# Altium project LP_ECG-X02.PrjPcb (part 3 of 3)

## Sheet LP_ECG_Power-X02.SchDoc: DB POWER
size Letter; Author: C. DEMOLDER; Engineer: C. DEMOLDER; Organization: GEORGIA TECH; Address1: NORTH AVE NW; Address2: ATLANTA, GA, 30332; DocumentNumber: P001; Revision: X01; SheetNumber: 3; SheetTotal: 4
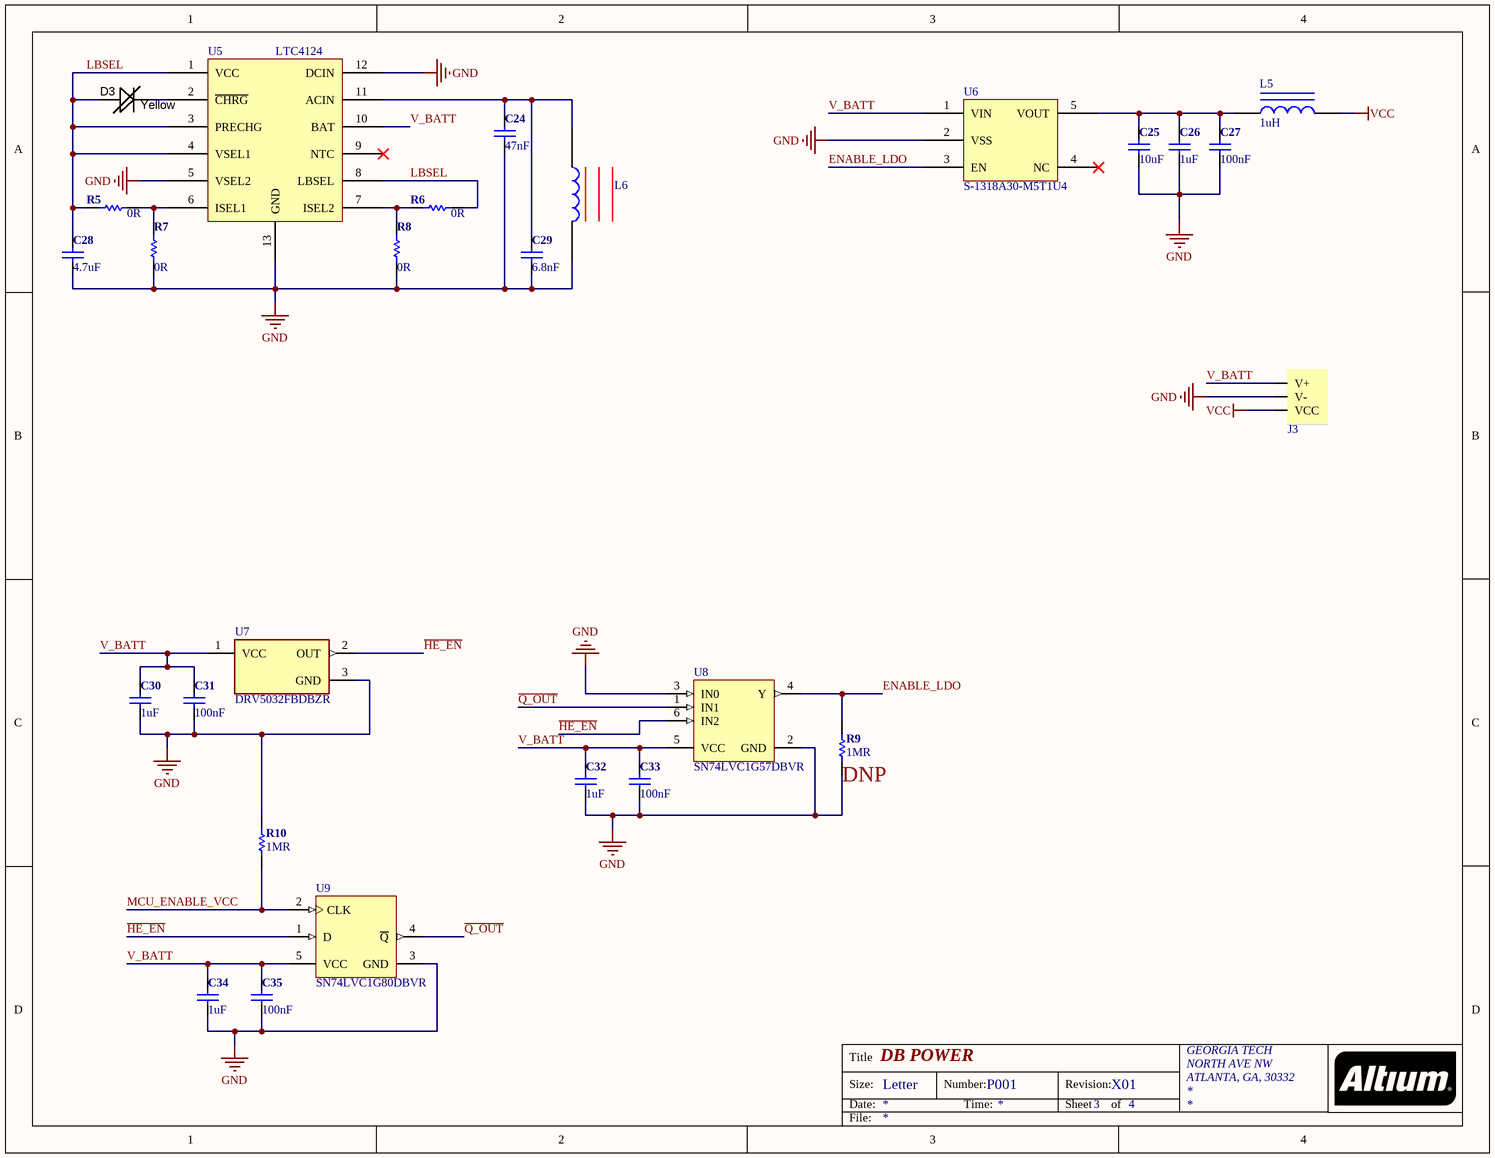
[diagram p2: LP_ECG_Power-X02.SchDoc]

### Parts
C24  47nF  [C0402]
C25  10uF  [C0402]
C26  1uF  [C0402]
C27  100nF  [C0402]
C28  4.7uF  [C0402]
C29  6.8nF  [C0402]
C30  1uF  [C0402]
C31  100nF  [C0402]
C32  1uF  [C0402]
C33  100nF  [C0402]
C34  1uF  [C0402]
C35  100nF  [C0402]
D3  Yellow  [LED_0402]
J3  SMD CONNECTOR FOR 40 mAh BATTERY  [battery_connector]  (value not drawn)
L5  1uH  [L0402]
L6  WIRELESS CHARGING COIL, RECEIVER  [760308101219]  (value not drawn)
R5  0R  [R0402]
R6  0R  [R0402]
R7  0R  [R0402]
R8  0R  [R0402]
R9  1MR  [R0402]
R10  1MR  [R0402]
U5  LTC4124  [12-LQFN]
U6  S-1318A30-M5T1U4  [SOT-23-5]
U7  DRV5032FBDBZR  [FP-DBZ0003A-MFG]
U8  SN74LVC1G57DBVR  [DBV0006A_M]
U9  SN74LVC1G80DBVR  [DBV0005A_N]

### Nets
GND: C24.2 C25.2 C26.2 C27.1 C28.2 C29.2 C30.2 C31.1 C32.2 C33.1 C34.2 C35.1 J3.2(V-) L6.2 R7.2 R8.2 R9.2 R10.1 U5.5(VSEL2) U5.12(DCIN) U5.13(GND) U6.2(VSS) U7.3(GND) U8.2(GND) U8.3(IN0) U9.3(GND)
VCC: J3.3(VCC) L5.2
~{HE_EN}: U7.2(OUT) U8.6(IN2) U9.1(D)
~{Q_OUT}: U8.1(IN1) U9.4(~{Q})
ENABLE_LDO: R9.1 U6.3(EN) U8.4(Y)
LBSEL: C28.1 D3.A R5.1 R6.2 U5.1(VCC) U5.3(PRECHG) U5.4(VSEL1) U5.8(LBSEL)
MCU_ENABLE_VCC: R10.2 U9.2(CLK)
V_BATT: C30.1 C31.2 C32.1 C33.2 C34.1 C35.2 J3.1(V+) U5.10(BAT) U6.1(VIN) U7.1(VCC) U8.5(VCC) U9.5(VCC)
NetC24_1: C24.1 C29.1 L6.1 U5.11(ACIN)
NetC25_1: C25.1 C26.1 C27.2 L5.1 U6.5(VOUT)
NetD3_K: D3.K U5.2(~{CHRG})
NetR5_2: R5.2 R7.1 U5.6(ISEL1)
NetR6_1: R6.1 R8.1 U5.7(ISEL2)

Not connected (* = marked no-connect by the designer): U5 9(NTC)*; U6 4(NC)*

### Notes on the sheet
- (near R9) DNP
- Title
- Size:
- Date:
- Letter
- Number:
- Time:
- Revision:
- Sheet
- of
- File:

### Library data of the parts
C24 = C-0402(1005): Ceramic Capacitor, Multilayer, Ceramic, 50V, 10% +Tol, 10% -Tol, X7R, 15% TC, 0.047uF, Surface Mount, 0402; Manufacturer: Murata; Manufacturer Part Number: GCM155R71H473KE02D; Multilayer: Yes; Reference Standard: AEC-Q200; ComponentLink1URL: https://datasheet.ciiva.com/169/product-169683.pdf; ComponentLink1Description: https://datasheet.ciiva.com/169/product-169683.pdf; Supplier 1: Digi-Key; Supplier Part Number 1: 490-13297-1-ND; RoHS: Yes; Category: Ceramic Capacitors; Stock 1: 809; Pricing 1: 1=0.10000, 10=0.05300, 50=0.02900, 100=0.02370, 500=0.01694, 1000=0.01331, 2500=0.01210, 5000=0.01113 (USD); Mount: Surface Mount; Number of Pins: 2; Dielectric Material: Ceramic; Package Shape: Rectangular; Size Code: 0402; Terminal Finish: Nickel; Min Operating Temperature: -55°C; Max Operating Temperature: 125°C; JESD-609 Code: e3; Capacitance: 47nF; Capacitor Type: Ceramic; Negative Tolerance: 10%; Package Style: SMTMeter; Packaging: Tape and Reel; Positive Tolerance: 10%; Rated DC Voltage (URdc): 50V; Temperature Characteristics Code: X7R; Termination: Wraparound; Length: 1mm; Width: 0.5mm; Height: 0.55mm; REACH SVHC: Yes; RoHS Compliant: Yes; ComponentLink2URL: https://datasheet.ciiva.com:443/pdfs/VipMasterIC/IC/MURE/MURE-S-A0004370842/MURE-S-A0004372843-1.pdf?src-supplier=IHS+Markit; ComponentLink2Description: https://datasheet.ciiva.com:443/pdfs/VipMasterIC/IC/MURE/MURE-S-A0004370842/MURE-S-A0004372843-1.pdf?src-supplier=IHS+Markit; ComponentLink3URL: http://www.mouser.com/ds/2/281/c03e-806517.pdf?src-supplier=Mouser; ComponentLink3Description: http://www.mouser.com/ds/2/281/c03e-806517.pdf?src-supplier=Mouser; ComponentLink4URL: http://www.murata.com/~/media/webrenewal/support/library/catalog/products/capacitor/mlcc/c03e.ashx?src-supplier=Digi-Key; ComponentLink4Description: http://www.murata.com/~/media/webrenewal/support/library/catalog/products/capacitor/mlcc/c03e.ashx?src-supplier=Digi-Key; ComponentLink5URL: http://search.murata.co.jp/Ceramy/image/img/A01X/G101/ENG/GCM155R71H473KE02-01.pdf?src-supplier=Digi-Key; ComponentLink5Description: http://search.murata.co.jp/Ceramy/image/img/A01X/G101/ENG/GCM155R71H473KE02-01.pdf?src-supplier=Digi-Key; ComponentLink6URL: http://search.murata.co.jp/Ceramy/image/img/A01X/partnumbering_e_02.pdf?src-supplier=Digi-Key; ComponentLink6Description: http://search.murata.co.jp/Ceramy/image/img/A01X/partnumbering_e_02.pdf?src-supplier=Digi-Key
C25 = C-0402(1005): Ceramic Capacitor, Non-polarized, Multilayer, Ceramic, 10V, 20% +Tol, 20% -Tol, X5R, 15% TC, 10uF, Surface Mount, 0402; Manufacturer: Kyocera AVX; Manufacturer Part Number: 0402ZD106MAT2A; Multilayer: Yes; ComponentLink1URL: https://datasheet.ciiva.com/169/product-169683.pdf; ComponentLink1Description: https://datasheet.ciiva.com/169/product-169683.pdf; Supplier 1: Digi-Key; Supplier Part Number 1: 478-10052-1-ND; RoHS: No; Category: Ceramic Capacitors; Stock 1: 111382; Pricing 1: 1=0.85000, 10=0.62400, 50=0.49900, 100=0.42770, 500=0.33858, 1000=0.28512, 2500=0.26730, 5000=0.24948 (USD); Mount: Surface Mount; Number of Pins: 2; Dielectric Material: Ceramic; Package Shape: Rectangular; Size Code: 0402; Terminal Finish: Nickel; Min Operating Temperature: -55°C; Max Operating Temperature: 85°C; JESD-609 Code: e3; Capacitance: 10uF; Capacitor Type: Ceramic; Negative Tolerance: 20%; Packaging: Tape and Reel; Positive Tolerance: 20%; Rated DC Voltage (URdc): 10V; Temperature Characteristics Code: X5R; Termination: Wraparound; ComponentLink2URL: https://datasheet.ciiva.com:443/pdfs/VipMasterIC/IC/AVXC/AVXC-S-A0009640604/AVXC-S-A0009640604-1.pdf?src-supplier=IHS+Markit; ComponentLink2Description: https://datasheet.ciiva.com:443/pdfs/VipMasterIC/IC/AVXC/AVXC-S-A0009640604/AVXC-S-A0009640604-1.pdf?src-supplier=IHS+Markit; ComponentLink3URL: http://datasheets.avx.com/cx5r.pdf?src-supplier=Digi-Key; ComponentLink3Description: http://datasheets.avx.com/cx5r.pdf?src-supplier=Digi-Key; ComponentLink4URL: http://catalogs.avx.com/SurfaceMount.pdf?src-supplier=Digi-Key; ComponentLink4Description: http://catalogs.avx.com/SurfaceMount.pdf?src-supplier=Digi-Key
C26 C30 C32 C34 = C-0402(1005): Ceramic Capacitor, Multilayer, Ceramic, 6.3V, 20% +Tol, 20% -Tol, X5R, 15% TC, 1uF, Surface Mount, 0402; Manufacturer: Yageo; Manufacturer Part Number: CC0402MRX5R5BB105; Dissipation Factor: 10%; ComponentLink1URL: https://datasheet.ciiva.com/169/product-169683.pdf; ComponentLink1Description: https://datasheet.ciiva.com/169/product-169683.pdf; Supplier 1: Digi-Key; Supplier Part Number 1: 311-1441-1-ND; RoHS: Yes; Category: Ceramic Capacitors; Stock 1: 16697; Pricing 1: 1=0.13000, 10=0.08900, 100=0.04200, 500=0.02946, 1000=0.02439, 2500=0.02270, 5000=0.02076 (USD); Mount: Surface Mount; Case/Package: 0402; Number of Pins: 2; Case Code (Imperial): 0402; Case Code (Metric): 1005; Min Operating Temperature: -55°C; Max Operating Temperature: 85°C; Capacitance: 1uF; Tolerance: 20%; Voltage Rating: 6.3V; Voltage Rating (DC): 6.3V; Packaging: Tape and Reel; Package Quantity: 1; Dielectric: X5R; Termination: SMD/SMT; Composition: Ceramic; Length: 1mm; Height: 0.5mm; Width: 0.5mm; Thickness: 0.022inch; Depth: 0.5mm; Lead Free: Lead Free; Halogen Free: Halogen Free; ComponentLink2URL: https://datasheet.ciiva.com:443/pdfs/VipMasterIC/IC/YAGO/YAGO-S-A0006851646/YAGO-S-A0006851646-1.pdf?src-supplier=IHS+Markit; ComponentLink2Description: https://datasheet.ciiva.com:443/pdfs/VipMasterIC/IC/YAGO/YAGO-S-A0006851646/YAGO-S-A0006851646-1.pdf?src-supplier=IHS+Markit; ComponentLink3URL: https://datasheet.ciiva.com/176/mlccorderingcode-176806.pdf?src-supplier=Digi-Key; ComponentLink3Description: https://datasheet.ciiva.com/176/mlccorderingcode-176806.pdf?src-supplier=Digi-Key; ComponentLink4URL: https://datasheet.ciiva.com/176/mlccorderingcode-176807.pdf?src-supplier=Digi-Key; ComponentLink4Description: https://datasheet.ciiva.com/176/mlccorderingcode-176807.pdf?src-supplier=Digi-Key; ComponentLink5URL: https://datasheet.ciiva.com/176/mlccorderingcode-176808.pdf?src-supplier=Digi-Key; ComponentLink5Description: https://datasheet.ciiva.com/176/mlccorderingcode-176808.pdf?src-supplier=Digi-Key
C27 C31 C33 C35 = C-0402(1005): Ceramic Capacitor, Multilayer, Ceramic, 25V, 10% +Tol, 10% -Tol, X5R, 15% TC, 0.1uF, Surface Mount, 0402; Manufacturer: Taiyo Yuden; Manufacturer Part Number: TMK105BJ104KV-F; ComponentLink1URL: https://datasheet.ciiva.com/169/product-169683.pdf; ComponentLink1Description: https://datasheet.ciiva.com/169/product-169683.pdf; Supplier 1: Digi-Key; Supplier Part Number 1: 587-1456-1-ND; RoHS: Yes; Category: Ceramic Capacitors; Stock 1: 27456801; Pricing 1: 1=0.10000, 10=0.04600, 100=0.02050, 500=0.01464, 1000=0.01150, 2500=0.01045, 5000=0.00961 (USD); Mount: Surface Mount; Case/Package: 0402; Number of Pins: 2; Weight: 2.3E-05oz; Case Code (Imperial): 0402; Case Code (Metric): 1005; Min Operating Temperature: -55°C; Max Operating Temperature: 85°C; Capacitance: 100nF; Tolerance: 10%; Packaging: Tape and Reel; Dielectric: X5R; Voltage Rating (DC): 25V; Voltage Rating: 25V; Package Quantity: 1; Termination: SMD/SMT; Composition: Ceramic; Voltage: 25V; Length: 1mm; Height: 0.5mm; Width: 0.5mm; Depth: 0.5mm; Thickness: 0.022inch; REACH SVHC: No SVHC; Lead Free: Lead Free; Halogen Free: Halogen Free; ComponentLink2URL: https://datasheet.ciiva.com:443/pdfs/VipMasterIC/IC/TAIY/TAIY-S-A0009103435/TAIY-S-A0009103038-1.pdf?src-supplier=IHS+Markit; ComponentLink2Description: https://datasheet.ciiva.com:443/pdfs/VipMasterIC/IC/TAIY/TAIY-S-A0009103435/TAIY-S-A0009103038-1.pdf?src-supplier=IHS+Markit; ComponentLink3URL: https://datasheet.ciiva.com/30051/25tmk105bj104kv-f-30051094.pdf?src-supplier=Onlinecomponents.com; ComponentLink3Description: https://datasheet.ciiva.com/30051/25tmk105bj104kv-f-30051094.pdf?src-supplier=Onlinecomponents.com; ComponentLink4URL: https://datasheet.ciiva.com/15922/28tmk105bj104kv-f-15922315.pdf?src-supplier=Onlinecomponents.com; ComponentLink4Description: https://datasheet.ciiva.com/15922/28tmk105bj104kv-f-15922315.pdf?src-supplier=Onlinecomponents.com; ComponentLink5URL: https://datasheet.ciiva.com/131/tmk105bj104kv-f-ss-131420.pdf?src-supplier=Digi-Key; ComponentLink5Description: https://datasheet.ciiva.com/131/tmk105bj104kv-f-ss-131420.pdf?src-supplier=Digi-Key; ComponentLink6URL: https://datasheet.ciiva.com/22768/1693457-22768649.pdf?src-supplier=Farnell; ComponentLink6Description: https://datasheet.ciiva.com/22768/1693457-22768649.pdf?src-supplier=Farnell
C28 = C-0402(1005): Ceramic Capacitor, Multilayer, Ceramic, 6.3V, 20% +Tol, 20% -Tol, X5R, 15% TC, 4.7uF, Surface Mount, 0402; Manufacturer: Murata; Manufacturer Part Number: GRM155R60J475ME87J; Multilayer: Yes; ComponentLink1URL: https://datasheet.ciiva.com/169/product-169683.pdf; ComponentLink1Description: https://datasheet.ciiva.com/169/product-169683.pdf; Supplier 1: Digi-Key; Supplier Part Number 1: 490-18211-1-ND; RoHS: Yes; Category: Ceramic Capacitors; Stock 1: 105828; Pricing 1: 1=0.15000, 10=0.10500, 50=0.05980, 100=0.04950, 500=0.03472, 1000=0.02875, 2500=0.02676, 5000=0.02448 (USD); Mount: Surface Mount; Number of Pins: 2; Dielectric Material: Ceramic; Package Shape: Rectangular; Size Code: 0402; Terminal Finish: Nickel; Min Operating Temperature: -55°C; Max Operating Temperature: 85°C; JESD-609 Code: e3; Capacitance: 4.7uF; Capacitor Type: Ceramic; Negative Tolerance: 20%; Package Style: SMTMeter; Packaging: Tape and Reel; Positive Tolerance: 20%; Rated DC Voltage (URdc): 6.3V; Temperature Characteristics Code: X5R; Termination: Wraparound; Length: 1mm; Width: 0.5mm; Height: 0.5mm; REACH SVHC: Yes; RoHS Compliant: Yes; ComponentLink2URL: https://datasheet.ciiva.com:443/pdfs/VipMasterIC/IC/MURE/MURE-S-A0004362469/MURE-S-A0004364141-1.pdf?src-supplier=IHS+Markit; ComponentLink2Description: https://datasheet.ciiva.com:443/pdfs/VipMasterIC/IC/MURE/MURE-S-A0004362469/MURE-S-A0004364141-1.pdf?src-supplier=IHS+Markit; ComponentLink3URL: https://search.murata.co.jp/Ceramy/image/img/A01X/G101/ENG/GRM155R60J475ME87-01.pdf?src-supplier=Digi-Key; ComponentLink3Description: https://search.murata.co.jp/Ceramy/image/img/A01X/G101/ENG/GRM155R60J475ME87-01.pdf?src-supplier=Digi-Key
C29 = C-0402(1005): Ceramic Capacitor, Multilayer, Ceramic, 50V, 10% +Tol, 10% -Tol, X7R, 15% TC, 0.0068uF, Surface Mount, 0402; Manufacturer: Murata; Manufacturer Part Number: GCM155R71H682KA55D; Multilayer: Yes; Reference Standard: AEC-Q200; ComponentLink1URL: https://datasheet.ciiva.com/169/product-169683.pdf; ComponentLink1Description: https://datasheet.ciiva.com/169/product-169683.pdf; Supplier 1: Digi-Key; Supplier Part Number 1: 490-11152-1-ND; RoHS: Yes; Category: Ceramic Capacitors; Stock 1: 86177; Pricing 1: 1=0.10000, 10=0.04500, 50=0.02460, 100=0.02020, 500=0.01440, 1000=0.01131, 2500=0.01028, 5000=0.00946 (USD); Mount: Surface Mount; Number of Pins: 2; Dielectric Material: Ceramic; Package Shape: Rectangular; Size Code: 0402; Terminal Finish: Nickel; Min Operating Temperature: -55°C; Max Operating Temperature: 125°C; JESD-609 Code: e3; Capacitance: 6.8nF; Capacitor Type: Ceramic; Negative Tolerance: 10%; Package Style: SMTMeter; Packaging: Tape and Reel; Positive Tolerance: 10%; Rated DC Voltage (URdc): 50V; Temperature Characteristics Code: X7R; Termination: Wraparound; Length: 1mm; Width: 0.5mm; Height: 0.55mm; REACH SVHC: Yes; RoHS Compliant: Yes; ComponentLink2URL: https://datasheet.ciiva.com:443/pdfs/VipMasterIC/IC/MURE/MURE-S-A0004370842/MURE-S-A0004371992-1.pdf?src-supplier=IHS+Markit; ComponentLink2Description: https://datasheet.ciiva.com:443/pdfs/VipMasterIC/IC/MURE/MURE-S-A0004370842/MURE-S-A0004371992-1.pdf?src-supplier=IHS+Markit; ComponentLink3URL: https://datasheet.ciiva.com/163/s0717e-163461.pdf?src-supplier=Digi-Key; ComponentLink3Description: https://datasheet.ciiva.com/163/s0717e-163461.pdf?src-supplier=Digi-Key
D3 = LED_0402(1005): Single Color LED, Super Bright Yellow, Water Clear, 0.8mm; Manufacturer: Kingbright; Manufacturer Part Number: APHHS1005SYCK; Test Current: 20mA; Forward Voltage: 2V; Luminous Intensity: 150mcd; Viewing Angle: 120°; Number of LEDs: 1; Dominant Wavelength: 590nm; Lens Style: Clear,Flat; Supplier 1: Digi-Key; Supplier Part Number 1: 754-1105-1-ND; RoHS: Yes; Category: LEDs; Stock 1: 1790; Pricing 1: 1=0.44000, 10=0.31200, 100=0.18200, 500=0.12480, 1000=0.10400 (USD); Mount: Surface Mount; Case/Package: 0402; Number of Pins: 2; Color: Yellow; Case Code (Imperial): 0402; Case Code (Metric): 1005; Lens Color: Clear; Min Operating Temperature: -40°C; Max Operating Temperature: 85°C; Illumination Color: Yellow; Forward Current: 20mA; Packaging: Tape and Reel; Package Quantity: 2000; Length: 1mm; Height: 0.6mm; Width: 0.5mm; Lead Free: Lead Free; ComponentLink1URL: https://datasheet.ciiva.com:443/pdfs/VipMasterIC/IC/KBEC/KBEC-S-A0008947180/KBEC-S-A0008958019-1.pdf?src-supplier=IHS+Markit; ComponentLink1Description: https://datasheet.ciiva.com:443/pdfs/VipMasterIC/IC/KBEC/KBEC-S-A0008947180/KBEC-S-A0008958019-1.pdf?src-supplier=IHS+Markit; ComponentLink2URL: https://datasheet.ciiva.com/4688/aphhs1005syck-76875-4688936.pdf?src-supplier=Mouser; ComponentLink2Description: https://datasheet.ciiva.com/4688/aphhs1005syck-76875-4688936.pdf?src-supplier=Mouser; ComponentLink3URL: https://datasheet.ciiva.com/2114/aphhs1005syck-2114041.pdf?src-supplier=Digi-Key; ComponentLink3Description: https://datasheet.ciiva.com/2114/aphhs1005syck-2114041.pdf?src-supplier=Digi-Key; ComponentLink4URL: https://datasheet.ciiva.com/14603/70062834-14603866.pdf?src-supplier=Allied+Electronics; ComponentLink4Description: https://datasheet.ciiva.com/14603/70062834-14603866.pdf?src-supplier=Allied+Electronics; ComponentLink5URL: https://datasheet.ciiva.com/2114/aphhs1005syck-2114043.pdf?src-supplier=Digi-Key; ComponentLink5Description: https://datasheet.ciiva.com/2114/aphhs1005syck-2114043.pdf?src-supplier=Digi-Key; ComponentLink6URL: https://datasheet.ciiva.com/16412/aphhs1005syck-16412188.pdf?src-supplier=Future+Electronics; ComponentLink6Description: https://datasheet.ciiva.com/16412/aphhs1005syck-16412188.pdf?src-supplier=Future+Electronics
J3 = SMD_BATTERY_CONNECTOR: Lithium Battery 3.7V 40mAh Rechargeable
L5 = Inductor Iron: General Purpose Inductor, 1uH, 20%, 1 Element, Ferrite-Core, SMD, 0402; Manufacturer: TDK; Manufacturer Part Number: MLZ1005M1R0WT000; Current Rating: 450mA; Saturation Current: 100mA; Shielding: Shielded; DC Resistance (DCR): 455mR; Self Resonant Frequency: 170MHz; Test Frequency: 2MHz; Supplier 1: Digi-Key; Supplier Part Number 1: 445-6379-1-ND; RoHS: Yes; Category: Fixed Inductors; Pricing 1: 1=0.29000, 10=0.25800, 100=0.17710, 500=0.15134, 1000=0.11592, 2500=0.10948 (USD); Mount: Surface Mount; Case/Package: 0402; Core Material: Ferrite; Case Code (Imperial): 0402; Case Code (Metric): 1005; Min Operating Temperature: -55°C; Max Operating Temperature: 125°C; Package Quantity: 10000; Packaging: Tape and Reel; Tolerance: 20%; Inductance: 1uH; Length: 0.039inch; Width: 0.02inch; Height - Seated (Max): 0.022inch; ComponentLink1URL: https://datasheet.ciiva.com:443/pdfs/VipMasterIC/IC/TDKC/TDKC-S-A0006811779/TDKC-S-A0006811779-1.pdf?src-supplier=IHS+Markit; ComponentLink1Description: https://datasheet.ciiva.com:443/pdfs/VipMasterIC/IC/TDKC/TDKC-S-A0006811779/TDKC-S-A0006811779-1.pdf?src-supplier=IHS+Markit; ComponentLink2URL: https://datasheet.ciiva.com/29699/inductor-commercial-decoupling-mlz-en-29699052.pdf?src-supplier=Digi-Key; ComponentLink2Description: https://datasheet.ciiva.com/29699/inductor-commercial-decoupling-mlz-en-29699052.pdf?src-supplier=Digi-Key; ComponentLink3URL: https://datasheet.ciiva.com/29699/inductor-commercial-decoupling-mlz-en-29699053.pdf?src-supplier=Digi-Key; ComponentLink3Description: https://datasheet.ciiva.com/29699/inductor-commercial-decoupling-mlz-en-29699053.pdf?src-supplier=Digi-Key
L6 = WIRELESS_CHARGING_COIL: General Purpose Inductor, 11.8uH, 10%, 1 Element; Manufacturer: Wurth Electronics; Current Rating: 700mA; Saturation Current: 1.5A; DC Resistance (DCR): 750mR; Self Resonant Frequency: 22MHz; Supplier 1: Digi-Key; Supplier Part Number 1: 732-9675-ND; Manufacturer Part Number: 760308101219; RoHS: Yes; Stock 1: 168; Pricing 1: 1=7.43000, 10=7.04000, 32=6.49000, 64=5.94000, 128=5.17000 (USD); Min Operating Temperature: -20°C; Max Operating Temperature: 105°C; Logic Function: Receiver; Inductance: 11.8uH; Tolerance: 10%; Inductance Tolerance: 10%; Height: 0.02inch; REACH SVHC: Unknown; ComponentLink1URL: https://datasheet.ciiva.com:443/pdfs/VipMasterIC/IC/MIDC/MIDC-S-A0003386501/MIDC-S-A0003386501-1.pdf?src-supplier=IHS+Markit; ComponentLink1Description: https://datasheet.ciiva.com:443/pdfs/VipMasterIC/IC/MIDC/MIDC-S-A0003386501/MIDC-S-A0003386501-1.pdf?src-supplier=IHS+Markit; ComponentLink2URL: http://www.farnell.com/datasheets/2039993.pdf?src-supplier=Farnell; ComponentLink2Description: http://www.farnell.com/datasheets/2039993.pdf?src-supplier=Farnell; ComponentLink3URL: http://www.farnell.com/datasheets/2039993.pdf?src-supplier=Element14; ComponentLink3Description: http://www.farnell.com/datasheets/2039993.pdf?src-supplier=Element14
R5-R8 = R-0402(1005): Fixed Resistor, Metal Glaze/thick Film, 0.0625W, 0ohm, Surface Mount, 0402; Manufacturer: Yageo; Manufacturer Part Number: AC0402JR-070RL; Rated Power Dissipation (P): 62.5mW; Rated Temperature: 70°C; Package Height: 0.32mm; Package Length: 1mm; Package Width: 0.5mm; Reference Standard: AEC-Q200; Supplier 1: Digi-Key; Supplier Part Number 1: 311-0.0LBCT-ND; RoHS: Yes; Category: Chip SMD Resistors; Stock 1: 1061562; Pricing 1: 1=0.10000, 10=0.01800, 25=0.01320, 50=0.01000, 100=0.00740, 250=0.00564, 500=0.00450, 1000=0.00331, 5000=0.00238 (USD); Mount: Surface Mount; Number of Pins: 2; Package Shape: Rectangular; Size Code: 0402; Terminal Finish: Nickel; Min Operating Temperature: -55°C; Max Operating Temperature: 155°C; JESD-609 Code: e3; Resistor Type: FIXED RESISTOR; Construction: Chip; Package Style: SMTMeter; Packaging: Tape and Reel; Resistance: 0R; Technology: METAL GLAZE/THICK FILM; Termination: Wraparound; REACH SVHC: Yes; RoHS Compliant: Yes; ComponentLink1URL: https://datasheet.ciiva.com:443/pdfs/VipMasterIC/IC/YAGO/YAGO-S-A0003597364/YAGO-S-A0003597364-1.pdf?src-supplier=IHS+Markit; ComponentLink1Description: https://datasheet.ciiva.com:443/pdfs/VipMasterIC/IC/YAGO/YAGO-S-A0003597364/YAGO-S-A0003597364-1.pdf?src-supplier=IHS+Markit; ComponentLink2URL: http://www.mouser.com/ds/2/447/yageodocoutput-1111992.pdf?src-supplier=Mouser; ComponentLink2Description: http://www.mouser.com/ds/2/447/yageodocoutput-1111992.pdf?src-supplier=Mouser; ComponentLink3URL: http://www.yageo.com/NewPortal/yageodocoutput?fileName=/pdf/R-Chip/PYu-AC_51_RoHS_L_6.pdf&src-supplier=Digi-Key; ComponentLink3Description: http://www.yageo.com/NewPortal/yageodocoutput?fileName=/pdf/R-Chip/PYu-AC_51_RoHS_L_6.pdf&src-supplier=Digi-Key; ComponentLink4URL: http://www.yageo.com/documents/recent/PYu-AC_51_RoHS_L_2_revised.pdf?src-supplier=Future+Electronics; ComponentLink4Description: http://www.yageo.com/documents/recent/PYu-AC_51_RoHS_L_2_revised.pdf?src-supplier=Future+Electronics
R9 R10 = R-0402(1005): Fixed Resistor, Metal Glaze/thick Film, 0.0625W, 1000000ohm, 50V, 1% +/-Tol, 100ppm/Cel, Surface Mount, 0402; Manufacturer: Yageo; Manufacturer Part Number: AC0402FR-071ML; Additional Feature: LASER TRIMMABLE; Rated Power Dissipation (P): 62.5mW; Rated Temperature: 70°C; Temperature Coefficient: 100ppm/°C; Package Height: 0.32mm; Package Length: 1mm; Package Width: 0.5mm; Reference Standard: AEC-Q200; Supplier 1: Digi-Key; Supplier Part Number 1: YAG3450CT-ND; RoHS: Yes; Category: Chip SMD Resistors; Stock 1: 11166; Pricing 1: 1=0.10000, 10=0.01900, 100=0.00780, 1000=0.00350, 2500=0.00304, 5000=0.00251 (USD); Mount: Surface Mount; Number of Pins: 2; Package Shape: Rectangular; Size Code: 0402; Terminal Finish: Nickel; Min Operating Temperature: -55°C; Max Operating Temperature: 155°C; Tolerance: 1%; JESD-609 Code: e3; Resistor Type: FIXED RESISTOR; Construction: Chip; Package Style: SMTMeter; Packaging: Tape and Reel; Resistance: 1MR; Technology: METAL GLAZE/THICK FILM; Termination: Wraparound; Working Voltage: 50V; ComponentLink1URL: https://datasheet.ciiva.com:443/pdfs/VipMasterIC/IC/YAGO/YAGO-S-A0003597364/YAGO-S-A0003597364-1.pdf?src-supplier=IHS+Markit; ComponentLink1Description: https://datasheet.ciiva.com:443/pdfs/VipMasterIC/IC/YAGO/YAGO-S-A0003597364/YAGO-S-A0003597364-1.pdf?src-supplier=IHS+Markit; ComponentLink2URL: http://components.arrow.com/part/dataview/0323_03348700?src-supplier=Arrow+Europe; ComponentLink2Description: http://components.arrow.com/part/dataview/0323_03348700?src-supplier=Arrow+Europe; ComponentLink3URL: http://www.yageo.com/documents/recent/PYu-AC_51_RoHS_L_2.pdf?src-supplier=Mouser; ComponentLink3Description: http://www.yageo.com/documents/recent/PYu-AC_51_RoHS_L_2.pdf?src-supplier=Mouser; ComponentLink4URL: http://www.yageo.com/NewPortal/yageodocoutput?fileName=/pdf/R-Chip/PYu-AC_51_RoHS_L_6.pdf&src-supplier=Digi-Key; ComponentLink4Description: http://www.yageo.com/NewPortal/yageodocoutput?fileName=/pdf/R-Chip/PYu-AC_51_RoHS_L_6.pdf&src-supplier=Digi-Key; ComponentLink5URL: http://www.yageo.com/documents/recent/PYu-AC_51_RoHS_L_2_revised.pdf?src-supplier=Future+Electronics; ComponentLink5Description: http://www.yageo.com/documents/recent/PYu-AC_51_RoHS_L_2_revised.pdf?src-supplier=Future+Electronics
U5 = LTC4124: Power Supply Support Circuit, Adjustable, 1 Channel, CMOS; Manufacturer: Analog Devices; Manufacturer Part Number: LTC4124EV#TRMPBF; Supplier 1: Digi-Key; Supplier Part Number 1: LTC4124EV#TRMPBFCT-ND; RoHS: Yes; Category: Battery Management; Pricing 1: 1=6.36000, 10=5.74300, 25=5.47600, 100=4.75470, 250=4.54104 (USD); ComponentLink1URL: https://datasheet.ciiva.com:443/pdfs/VipMasterIC/IC/ANDI/ANDI-S-A0007901877/ANDI-S-A0007901877-1.pdf?src-supplier=IHS+Markit; ComponentLink1Description: https://datasheet.ciiva.com:443/pdfs/VipMasterIC/IC/ANDI/ANDI-S-A0007901877/ANDI-S-A0007901877-1.pdf?src-supplier=IHS+Markit
U6 = S-1318A30-M5T1U4: Fixed Positive LDO Regulator; Manufacturer: ABLIC; Supplier 1: Digi-Key; Supplier Part Number 1: 1662-S-1318A30-M5T1U4CT-ND; Manufacturer Part Number: S-1318A30-M5T1U4; RoHS: Yes
U7 = CMP-04937-000003-1: LP HALL 32FBDBZR; Manufacturer: Texas Instruments; Sensing Method: Hall Effect; Max Supply Current: 2.6mA; Max Output Current: 5mA; ComponentLink2Description: Datasheet; ComponentLink2URL: http://www.ti.com/lit/ds/symlink/drv5032.pdf; Supplier 1: Digi-Key; Supplier Part Number 1: 296-47323-1-ND; Manufacturer Part Number: DRV5032FBDBZR; RoHS: No; Category: Integrated Circuits (ICs); Stock 1: 6326; Pricing 1: 1=0.80000, 5=0.76600, 10=0.66600, 25=0.58520, 50=0.48600, 100=0.41400, 500=0.36000, 1000=0.31500 (USD); Case/Package: TO-236-3; Min Operating Temperature: -40°C; Max Operating Temperature: 85°C; Packaging: Cut Tape; ComponentLink1URL: https://www.ti.com:443/lit/ds/symlink/drv5032.pdf?src-supplier=IHS+Markit; ComponentLink1Description: https://www.ti.com:443/lit/ds/symlink/drv5032.pdf?src-supplier=IHS+Markit; ComponentLink3URL: http://www.ti.com/lit/ds/symlink/drv5032.pdf?src-supplier=Digi-Key; ComponentLink3Description: http://www.ti.com/lit/ds/symlink/drv5032.pdf?src-supplier=Digi-Key; ComponentLink4URL: http://www.ti.com/general/docs/suppproductinfo.tsp?distId=10&amp;gotoUrl=http%3A%2F%2Fwww.ti.com%2Flit%2Fgpn%2Fdrv5032&src-supplier=Digi-Key; ComponentLink4Description: http://www.ti.com/general/docs/suppproductinfo.tsp?distId=10&amp;gotoUrl=http%3A%2F%2Fwww.ti.com%2Flit%2Fgpn%2Fdrv5032&src-supplier=Digi-Key
U8 = CMP-0859-00228-3: CONFIGURABLE MULTIPLE-FUNCTION GATE, DBV0006A, LARGE T&R; Manufacturer: Texas Instruments; Number of Inputs: 3; Min Supply Voltage: 1.65V; Max Supply Voltage: 5.5V; Propagation Delay: 6.3ns; Logic Function: NAND GATE,AND GATE,NOR GATE,OR GATE,Inverter,Multi Function; Number of Circuits: 1; High Level Output Current: -32mA; Low Level Output Current: 32mA; Number of Input Lines: 2; Quiescent Current: 10uA; Schmitt Trigger Input: Yes; Turn-On Delay Time: 6.1ns; Supplier 1: Digi-Key; Supplier Part Number 1: 296-15574-1-ND; Manufacturer Part Number: SN74LVC1G57DBVR; RoHS: Yes; Category: Logic Gates; Stock 1: 11185; Pricing 1: 1=0.37000, 10=0.28100, 25=0.25320, 100=0.17480, 250=0.14720, 500=0.11960, 1000=0.09200 (USD); Mount: Surface Mount; Case/Package: SOT-23; Number of Pins: 6; Weight: 0.000229oz; Contact Plating: Gold; Min Operating Temperature: -40°C; Max Operating Temperature: 125°C; Package Quantity: 3000; Packaging: Tape and Reel; Number of Gates: 1; Number of Output Lines: 1; Number of Elements: 1; Number of Bits: 1; Output Current: 32mA; Number of Outputs: 1; Max Output Current: 32mA; Termination: SMD/SMT; Length: 3.05mm; Height: 1.3mm; Width: 1.75mm; Radiation Hardening: No; Lead Free: Lead Free; REACH SVHC: No SVHC; ComponentLink1URL: https://www.ti.com:443/lit/ds/symlink/sn74lvc1g57.pdf?src-supplier=IHS+Markit; ComponentLink1Description: https://www.ti.com:443/lit/ds/symlink/sn74lvc1g57.pdf?src-supplier=IHS+Markit; ComponentLink2URL: https://datasheet.ciiva.com/15090/getdatasheetpartid-173082-15090973.pdf?src-supplier=Verical; ComponentLink2Description: https://datasheet.ciiva.com/15090/getdatasheetpartid-173082-15090973.pdf?src-supplier=Verical; ComponentLink3URL: https://datasheet.ciiva.com/1880/sn74lvc1g57-1880083.pdf?src-supplier=Digi-Key; ComponentLink3Description: https://datasheet.ciiva.com/1880/sn74lvc1g57-1880083.pdf?src-supplier=Digi-Key; ComponentLink4URL: https://datasheet.ciiva.com/1880/sn74lvc1g57-1880084.pdf?src-supplier=Digi-Key; ComponentLink4Description: https://datasheet.ciiva.com/1880/sn74lvc1g57-1880084.pdf?src-supplier=Digi-Key; ComponentLink5URL: https://datasheet.ciiva.com/46395/1882763-46395382.pdf?src-supplier=Element14; ComponentLink5Description: https://datasheet.ciiva.com/46395/1882763-46395382.pdf?src-supplier=Element14; ComponentLink6URL: https://datasheet.ciiva.com/46439/1834192-46439175.pdf?src-supplier=Element14; ComponentLink6Description: https://datasheet.ciiva.com/46439/1834192-46439175.pdf?src-supplier=Element14; ComponentLink7URL: https://datasheet.ciiva.com/7783/1771418-7783483.pdf?src-supplier=Element14; ComponentLink7Description: https://datasheet.ciiva.com/7783/1771418-7783483.pdf?src-supplier=Element14; ComponentLink8URL: https://datasheet.ciiva.com/7783/1771418-7783484.pdf?src-supplier=Element14; ComponentLink8Description: https://datasheet.ciiva.com/7783/1771418-7783484.pdf?src-supplier=Element14; ComponentLink9URL: https://datasheet.ciiva.com/1880/sn74lvc1g57-1880082.pdf?src-supplier=Digi-Key; ComponentLink9Description: https://datasheet.ciiva.com/1880/sn74lvc1g57-1880082.pdf?src-supplier=Digi-Key; ComponentLink10URL: https://datasheet.ciiva.com/48702/001075107-da-01-en-ic-mult-fun-sn74lvc1g57dbvr-sot-23-6-tid-48702374.pdf?src-supplier=Conrad; ComponentLink10Description: https://datasheet.ciiva.com/48702/001075107-da-01-en-ic-mult-fun-sn74lvc1g57dbvr-sot-23-6-tid-48702374.pdf?src-supplier=Conrad
U9 = CMP-0859-00176-3: Single Positive-Edge-Triggered D-Type Flip-Flop, DBV0005A, LARGE T&R; Manufacturer: Texas Instruments; Min Supply Voltage: 1.65V; Number of Elements: 1; Max Supply Voltage: 5.5V; Clock Edge Trigger Type: Positive Edge; Propagation Delay: 9.9ns; Frequency: 160MHz; Logic Function: D-Type,Flip-Flop; Turn-On Delay Time: 1.1ns; High Level Output Current: -32mA; Low Level Output Current: 32mA; Polarity: Inverting; Supplier 1: Digi-Key; Supplier Part Number 1: 296-9851-1-ND; Manufacturer Part Number: SN74LVC1G80DBVR; RoHS: Yes; Category: Latches and Flip Flops; Stock 1: 12348; Pricing 1: 1=0.32000, 10=0.24000, 25=0.21000, 100=0.13590, 250=0.11252, 500=0.09000, 1000=0.06900 (USD); Mount: Surface Mount; Case/Package: SOT-23; Number of Pins: 5; Weight: 0.000557oz; Min Operating Temperature: -40°C; Max Operating Temperature: 125°C; Packaging: Tape and Reel; Package Quantity: 3000; Number of Bits per Element: 1; Number of Input Lines: 1; Number of Output Lines: 1; Number of Circuits: 1; Number of Bits: 1; Number of Gates: 1; Output Current: 32mA; Max Frequency: 160MHz; Radiation Hardening: No; Lead Free: Lead Free; REACH SVHC: No SVHC; ComponentLink1URL: https://www.ti.com:443/lit/ds/symlink/sn74lvc1g80.pdf?src-supplier=IHS+Markit; ComponentLink1Description: https://www.ti.com:443/lit/ds/symlink/sn74lvc1g80.pdf?src-supplier=IHS+Markit; ComponentLink2URL: https://datasheet.ciiva.com/15091/getdatasheetpartid-71921-15091286.pdf?src-supplier=Verical; ComponentLink2Description: https://datasheet.ciiva.com/15091/getdatasheetpartid-71921-15091286.pdf?src-supplier=Verical; ComponentLink3URL: https://datasheet.ciiva.com/1854/sn74lvc1g80-1854761.pdf?src-supplier=Digi-Key; ComponentLink3Description: https://datasheet.ciiva.com/1854/sn74lvc1g80-1854761.pdf?src-supplier=Digi-Key; ComponentLink4URL: https://datasheet.ciiva.com/46395/1882705-46395835.pdf?src-supplier=Element14; ComponentLink4Description: https://datasheet.ciiva.com/46395/1882705-46395835.pdf?src-supplier=Element14; ComponentLink5URL: https://datasheet.ciiva.com/1854/sn74lvc1g80-1854762.pdf?src-supplier=Digi-Key; ComponentLink5Description: https://datasheet.ciiva.com/1854/sn74lvc1g80-1854762.pdf?src-supplier=Digi-Key; ComponentLink6URL: https://datasheet.ciiva.com/8055/1831218-8055610.pdf?src-supplier=Element14; ComponentLink6Description: https://datasheet.ciiva.com/8055/1831218-8055610.pdf?src-supplier=Element14; ComponentLink7URL: https://datasheet.ciiva.com/1854/sn74lvc1g80-1854763.pdf?src-supplier=Digi-Key; ComponentLink7Description: https://datasheet.ciiva.com/1854/sn74lvc1g80-1854763.pdf?src-supplier=Digi-Key

## Nets that join several sheets
GND: LP_ECG_ECG-X02 (20 pins), LP_ECG_Main-X02 (18 pins), LP_ECG_Power-X02 (26 pins)
VCC: LP_ECG_ECG-X02 (5 pins), LP_ECG_Main-X02 (9 pins), LP_ECG_Power-X02 (J3.3 L5.2)
MAX30003_CS: LP_ECG_ECG-X02 (U3.15), LP_ECG_Main-X02 (U4.9)
MAX30003_INT1: LP_ECG_ECG-X02 (U3.21), LP_ECG_Main-X02 (U4.4)
MAX30003_INT2: LP_ECG_ECG-X02 (U3.20), LP_ECG_Main-X02 (U4.5)
MCU_ENABLE_ECG: LP_ECG_ECG-X02 (U2.3 X1.3), LP_ECG_Main-X02 (U4.12)
MCU_ENABLE_VCC: LP_ECG_Main-X02 (U4.14), LP_ECG_Power-X02 (R10.2 U9.2)
SCL_I2C: LP_ECG_ECG-X02 (U1.1), LP_ECG_Main-X02 (R1.2 U4.18)
SDA_I2C: LP_ECG_ECG-X02 (U1.6), LP_ECG_Main-X02 (R2.2 U4.19)
SPI_CLK: LP_ECG_ECG-X02 (U3.16), LP_ECG_Main-X02 (U4.8)
SPI_SDI: LP_ECG_ECG-X02 (U3.17), LP_ECG_Main-X02 (U4.7)
SPI_SDO: LP_ECG_ECG-X02 (U3.18), LP_ECG_Main-X02 (U4.6)
V_BATT: LP_ECG_ECG-X02 (U2.1), LP_ECG_Power-X02 (12 pins)